# Altium schematic sheet Design1.SchDoc
size A; SheetNumber: 1; SheetTotal: 1
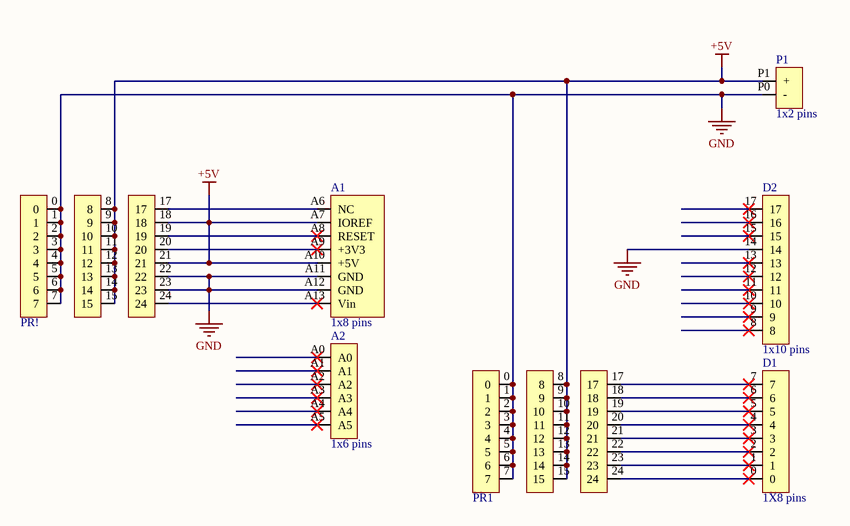
[diagram p0: Design1.SchDoc]

## Parts
A1  1x8 pins  [D0-7 - duplicate1]
A2  1x6 pins  [PCBComponent_1 - duplicate2]
D1  1X8 pins  [D0-7 - duplicate1]
D2  1x10 pins  [PCBComponent_1 - duplicate1]
P1  1x2 pins  [PCBComponent_1 - duplicate]
PR1  Pin row  [PCBComponent_1]  (value not drawn)
PR!  Pin row  [PCBComponent_1]  (value not drawn)

## Nets
+5V: A1.A7(IOREF) A1.A10(+5V) P1.P1(+) PR1.8 PR1.9 PR1.10 PR1.11 PR1.12 PR1.13 PR1.14 PR1.15 PR!.8 PR!.9 PR!.10 PR!.11 PR!.12 PR!.13 PR!.14 PR!.15 PR!.18 PR!.21
GND: A1.A11(GND) A1.A12(GND) D2.14 P1.P0(-) PR1.0 PR1.1 PR1.2 PR1.3 PR1.4 PR1.5 PR1.6 PR1.7 PR!.0 PR!.1 PR!.2 PR!.3 PR!.4 PR!.5 PR!.6 PR!.7 PR!.22 PR!.23
NetA1_A6: A1.A6(NC) PR!.17
NetA1_A8: A1.A8(RESET) PR!.19
NetA1_A9: A1.A9(+3V3) PR!.20
NetA1_A13: A1.A13(Vin) PR!.24
NetD1_0: D1.0 PR1.24
NetD1_1: D1.1 PR1.23
NetD1_2: D1.2 PR1.22
NetD1_3: D1.3 PR1.21
NetD1_4: D1.4 PR1.20
NetD1_5: D1.5 PR1.19
NetD1_6: D1.6 PR1.18
NetD1_7: D1.7 PR1.17

Not connected (* = marked no-connect by the designer): A2 A0* A1* A2* A3* A4* A5*; D2 8* 9* 10* 11* 12* 13* 15* 16* 17*

## Library data of the parts
A1 = 61300811121 (2): Board-To-Board Connector, Vertical, Wr-Phd Series, Through Hole, Header, 8, 2.54 Mm; Manufacturer: Wurth Electronics; Number of Positions: 8; Gender: Male; Connector Type: Male Pin; Pitch: 0.1inch; Supplier 1: Digi-Key; Manufacturer Part Number: 61300811121; RoHS: Yes; Category: Connectors; Stock 1: 5407; Pricing 1: 1=0.37000, 10=0.31500, 25=0.26320, 50=0.21900, 100=0.19900, 1000=0.18100 (USD); Mount: Through Hole; Contact Plating: Gold; Contact Material: Copper; Color: Black; Number of Rows: 1; Packaging: Bulk; Termination: Solder; Number of Contacts: 8; Contact Mating Length: 0.236inch; REACH SVHC: Unknown; RoHS Compliant: Yes; ComponentLink1URL: http://www.farnell.com/cad/1737268.pdf?src-supplier=Element14; ComponentLink1Description: http://www.farnell.com/cad/1737268.pdf?src-supplier=Element14; ComponentLink2URL: https://katalog.we-online.de/em/datasheet/6130xx11121.pdf?src-supplier=Digi-Key; ComponentLink2Description: https://katalog.we-online.de/em/datasheet/6130xx11121.pdf?src-supplier=Digi-Key; Supplier Part Number 1: 732-5321-ND
A2 = 61300611121: WURTH ELEKTRONIK - 61300611121 - Pin Header, Board-to-Board, 2.54 mm, 1 Rows, 6 Contacts, Through Hole, WR-PHD Series; Manufacturer: Wurth Electronics; Current Rating: 3A; Voltage Rating: 250V; Number of Positions: 6; Gender: Male; Connector Type: Male Pin; Pitch: 0.1inch; Supplier 1: Digi-Key; Manufacturer Part Number: 61300611121; RoHS: Yes; Category: Connectors; Stock 1: 43078; Pricing 1: 1=0.33000, 10=0.27900, 25=0.23200, 50=0.19400, 100=0.17600, 1000=0.16000 (USD); Mount: Through Hole; Contact Plating: Gold; Contact Material: Copper Alloy,Copper; Housing Material: PBT; Color: Black; Min Operating Temperature: -40°C; Max Operating Temperature: 125°C; Number of Rows: 1; Contact Gender: Male; Packaging: Bulk; Termination: Through Hole; Number of Contacts: 6; Contact Mating Length: 0.236inch; REACH SVHC: Unknown; Lead Free: Lead Free; ComponentLink1URL: http://www.mouser.com/ds/2/445/6130xx11121-538006.pdf?src-supplier=Mouser; ComponentLink1Description: http://www.mouser.com/ds/2/445/6130xx11121-538006.pdf?src-supplier=Mouser; ComponentLink2URL: http://www.farnell.com/cad/1737268.pdf?src-supplier=Element14; ComponentLink2Description: http://www.farnell.com/cad/1737268.pdf?src-supplier=Element14; ComponentLink3URL: https://katalog.we-online.de/em/datasheet/6130xx11121.pdf?src-supplier=Digi-Key; ComponentLink3Description: https://katalog.we-online.de/em/datasheet/6130xx11121.pdf?src-supplier=Digi-Key; Supplier Part Number 1: 732-5319-ND
D1 = 61300811121: Board-To-Board Connector, Vertical, Wr-Phd Series, Through Hole, Header, 8, 2.54 Mm; Manufacturer: Wurth Electronics; Color: Black; Number of Positions: 8; Gender: Male; Connector Type: Male Pin; Pitch: 0.1inch; Supplier 1: Digi-Key; Manufacturer Part Number: 61300811121; RoHS: Yes; Category: Connectors; Stock 1: 5407; Pricing 1: 1=0.37000, 10=0.31500, 25=0.26320, 50=0.21900, 100=0.19900, 1000=0.18100 (USD); Mount: Through Hole; Contact Plating: Gold; Contact Material: Copper; Number of Rows: 1; Packaging: Bulk; Termination: Solder; Number of Contacts: 8; Contact Mating Length: 0.236inch; REACH SVHC: Unknown; RoHS Compliant: Yes; ComponentLink1URL: https://katalog.we-online.de/em/datasheet/6130xx11121.pdf?src-supplier=Digi-Key; ComponentLink1Description: https://katalog.we-online.de/em/datasheet/6130xx11121.pdf?src-supplier=Digi-Key; ComponentLink2URL: http://www.farnell.com/cad/1737268.pdf?src-supplier=Element14; ComponentLink2Description: http://www.farnell.com/cad/1737268.pdf?src-supplier=Element14; Supplier Part Number 1: 732-5321-ND
D2 = 61301011121: WURTH ELEKTRONIK - 61301011121 - Pin Header, Board-to-Board, 2.54 mm, 1 Rows, 10 Contacts, Through Hole, WR-PHD Series; Manufacturer: Wurth Electronics; Color: Black; Current Rating: 3A; Number of Positions: 10; Insulation Resistance: 1GR; Voltage Rating: 250V; Gender: Male; Connector Type: Male Pin; Pitch: 2.54mm; Supplier 1: Digi-Key; Manufacturer Part Number: 61301011121; RoHS: Yes; Category: Headers and Wire Housings; Stock 1: 4797; Pricing 1: 1=0.89000, 10=0.87400, 50=0.80600, 100=0.73900, 200=0.67200 (USD); Mount: Through Hole; Contact Plating: Gold; Contact Material: Copper Alloy,Copper; Housing Material: PBT; Min Operating Temperature: -40°C; Max Operating Temperature: 125°C; Package Quantity: 1000; Packaging: Bulk; Termination: Solder; Number of Contacts: 10; Series: WR-PHD; Number of Rows: 1; Contact Gender: Male; Orientation: Straight; Contact Type: Male Pin; Length: 2.54mm; Width: 25.4mm; Height: 11.54mm; Contact Mating Length: 0.236inch; REACH SVHC: Unknown; RoHS Compliant: Yes; Flammability Rating: UL94 V-0; ComponentLink1URL: https://datasheet.ciiva.com/7631/1442175-7631321.pdf?src-supplier=Element14; ComponentLink1Description: https://datasheet.ciiva.com/7631/1442175-7631321.pdf?src-supplier=Element14; ComponentLink2URL: https://datasheet.ciiva.com/738/6130xx11121-738550.pdf?src-supplier=Digi-Key; ComponentLink2Description: https://datasheet.ciiva.com/738/6130xx11121-738550.pdf?src-supplier=Digi-Key; ComponentLink3URL: https://datasheet.ciiva.com/48700/001088187-da-01-en-wr-phd-tht-stiftleiste-61301011121-48700876.pdf?src-supplier=Conrad; ComponentLink3Description: https://datasheet.ciiva.com/48700/001088187-da-01-en-wr-phd-tht-stiftleiste-61301011121-48700876.pdf?src-supplier=Conrad; Supplier Part Number 1: 732-2670-ND
P1 = 61300211121: WURTH ELEKTRONIK - 61300211121 - Pin Header, Vertical, Board-to-Board, 2.54 mm, 1 Rows, 2 Contacts, Through Hole Straight; Manufacturer: Wurth Electronics; Current Rating: 3A; Voltage Rating: 250V; Number of Positions: 2; Gender: Male; Connector Type: Male Pin; Pitch: 0.1inch; Supplier 1: Digi-Key; Manufacturer Part Number: 61300211121; RoHS: Yes; Category: Headers and Wire Housings; Stock 1: 160304; Pricing 1: 1=0.13000, 10=0.10600, 25=0.08800, 50=0.07400, 100=0.06700, 1000=0.06100 (USD); Mount: Through Hole; Contact Plating: Gold; Housing Material: PBT; Contact Material: Copper Alloy,Copper; Color: Black; Min Operating Temperature: -40°C; Max Operating Temperature: 125°C; Number of Rows: 1; Contact Gender: Male; Packaging: Bulk; Termination: Through Hole; Number of Contacts: 2; Contact Mating Length: 0.236inch; REACH SVHC: Unknown; Lead Free: Lead Free; ComponentLink1URL: https://datasheet.ciiva.com/13619/6130xx11121-48870-13619345.pdf?src-supplier=Mouser; ComponentLink1Description: https://datasheet.ciiva.com/13619/6130xx11121-48870-13619345.pdf?src-supplier=Mouser; Supplier Part Number 1: 732-5315-ND